# Altium schematic sheet Connectors.SchDoc
size A4
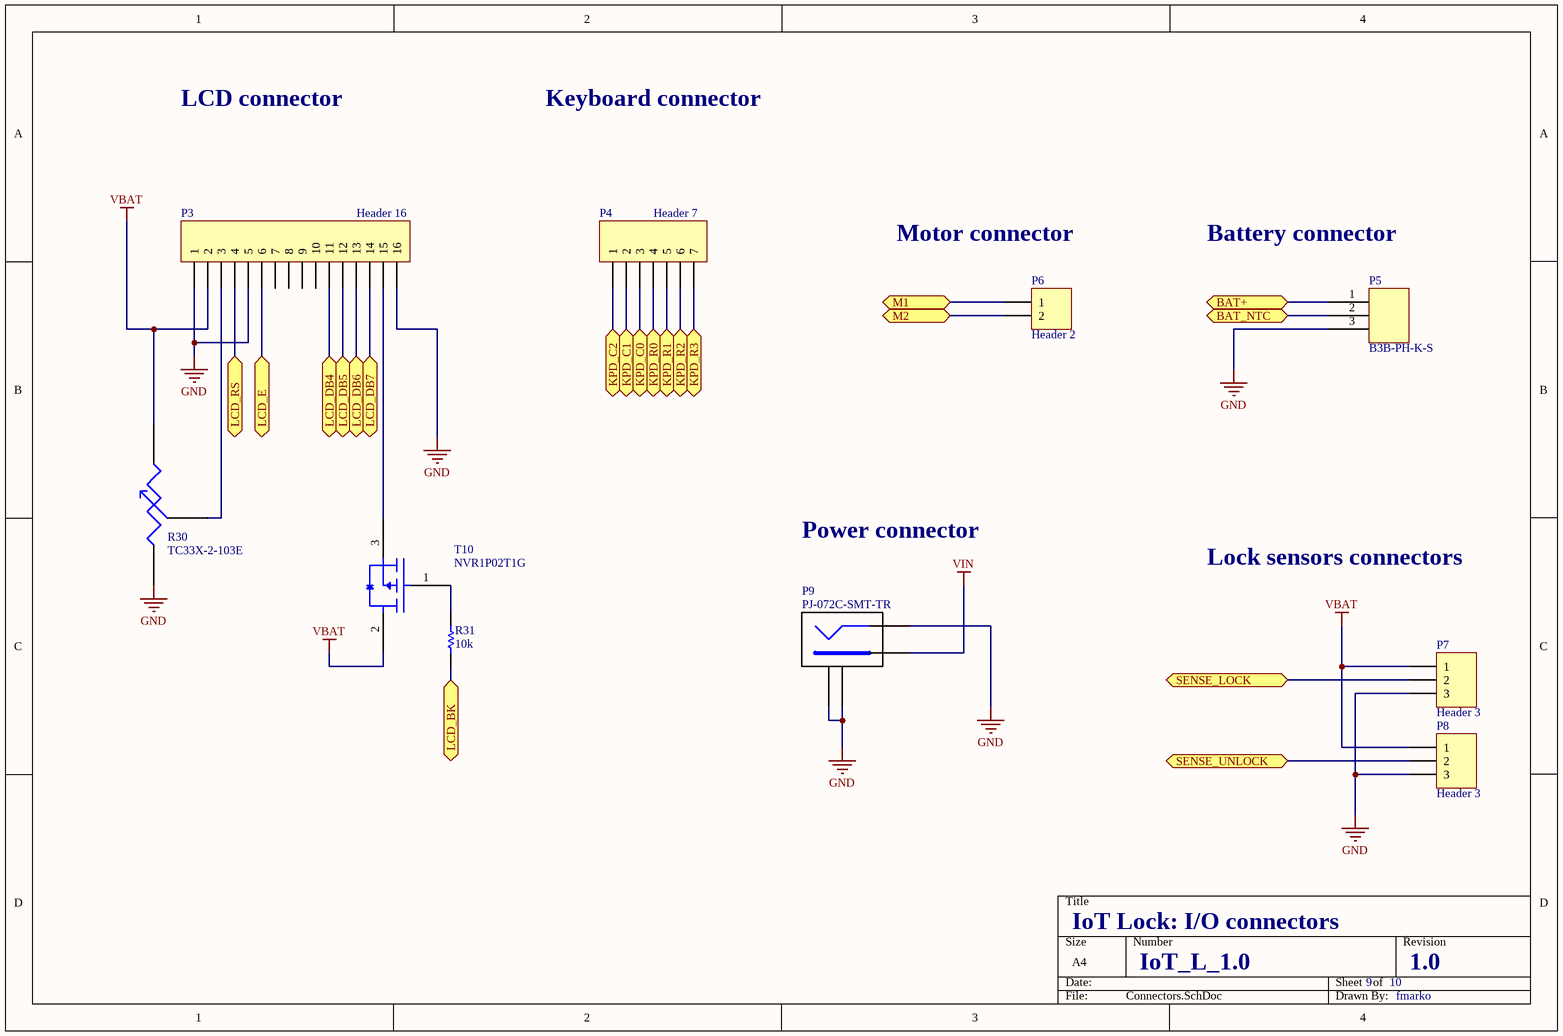
[diagram p0: Connectors.SchDoc]

## Parts
P3  Header 16  [HDR1X16]
P4  Header 7  [HDR1X7]
P5  B3B-PH-K-S  [B3B-PH-K-S]
P6  Header 2  [HDR1X2]
P7  Header 3  [HDR1X3]
P8  Header 3  [HDR1X3]
P9  PJ-072C-SMT-TR  [PJ-072C-SMT-TR_HOUSING]
R30  TC33X-2-103E  [TC33X-2-XXX_HOUSING]
R31  value 10k  [0402]  (hidden comment: Res Semi)
T10  NVR1P02T1G  [SOT95P237X111-3N]

## Ports
BAT+, BAT_NTC, KPD_C0, KPD_C1, KPD_C2, KPD_R0, KPD_R1, KPD_R2, KPD_R3, LCD_BK, LCD_DB4, LCD_DB5, LCD_DB6, LCD_DB7, LCD_E, LCD_RS, M1, M2, SENSE_LOCK, SENSE_UNLOCK

## Nets
GND: P3.1 P3.5 P3.16 P5.3 P7.3 P8.3 P9.2(GND) P9.3(SHD) P9.4(SHD) R30.1
VBAT: P3.2 P7.1 P8.1 R30.3 T10.2(S)
VIN: P9.1(PWR)
BAT+: P5.1 ; port BAT+
BAT_NTC: P5.2 ; port BAT_NTC
KPD_C0: P4.3 ; port KPD_C0
KPD_C1: P4.2 ; port KPD_C1
KPD_C2: P4.1 ; port KPD_C2
KPD_R0: P4.4 ; port KPD_R0
KPD_R1: P4.5 ; port KPD_R1
KPD_R2: P4.6 ; port KPD_R2
KPD_R3: P4.7 ; port KPD_R3
LCD_BK: R31.1 ; port LCD_BK
LCD_DB4: P3.11 ; port LCD_DB4
LCD_DB5: P3.12 ; port LCD_DB5
LCD_DB6: P3.13 ; port LCD_DB6
LCD_DB7: P3.14 ; port LCD_DB7
LCD_E: P3.6 ; port LCD_E
LCD_RS: P3.4 ; port LCD_RS
M1: P6.1 ; port M1
M2: P6.2 ; port M2
SENSE_LOCK: P7.2 ; port SENSE_LOCK
SENSE_UNLOCK: P8.2 ; port SENSE_UNLOCK
NetP3_3: P3.3 R30.2
NetP3_15: P3.15 T10.3(D)
NetR31_2: R31.2 T10.1(G)

Not connected (* = marked no-connect by the designer): P3 7 8 9 10

## Notes on the sheet
- LCD connector
- Keyboard connector
- Motor connector
- Battery connector
- Power connector
- Lock sensors connectors
- IoT Lock: I/O connectors
- IoT_L_1.0
- 9
- 10
- 1.0
- fmarko

## Library data of the parts
P3 = Header 16: Header, 16-Pin; LatestRevisionDate: 17-Jul-2002; LatestRevisionNote: Re-released for DXP Platform.; Publisher: Altium Limited
P4 = Header 7: Header, 7-Pin; LatestRevisionDate: 17-Jul-2002; LatestRevisionNote: Re-released for DXP Platform.; Publisher: Altium Limited
P5 = B3B-PH-K-S: JST connector, 3-pin, 2mm pitch
P6 = Header 2: Header, 2-Pin; LatestRevisionDate: 17-Jul-2002; LatestRevisionNote: Re-released for DXP Platform.; Publisher: Altium Limited
P7 P8 = Header 3: Header, 3-Pin; LatestRevisionDate: 17-Jul-2002; LatestRevisionNote: Re-released for DXP Platform.; Publisher: Altium Limited
P9 = PJ-072C-SMT-TR: CUI Barrel power connector, 1X3.4mm
R30 = TC33X-2-103E: SMD trimmer resistor, 10k
R31 = Res Semi: Semiconductor Resistor; Published: 8-Jun-2000; LatestRevisionDate: 17-Jul-2002; LatestRevisionNote: Re-released for DXP Platform.; PackageReference: AXIAL-0.5; Publisher: Altium Limited; PackageDescription: Axial Device, Thru-Hole; 2 Leads; 0.5 in Pin Spacing
T10 = NVR1P02T1G: P-Channel MOSFET